# EAGLE schematic PCB (EAGLE 9.5.2)
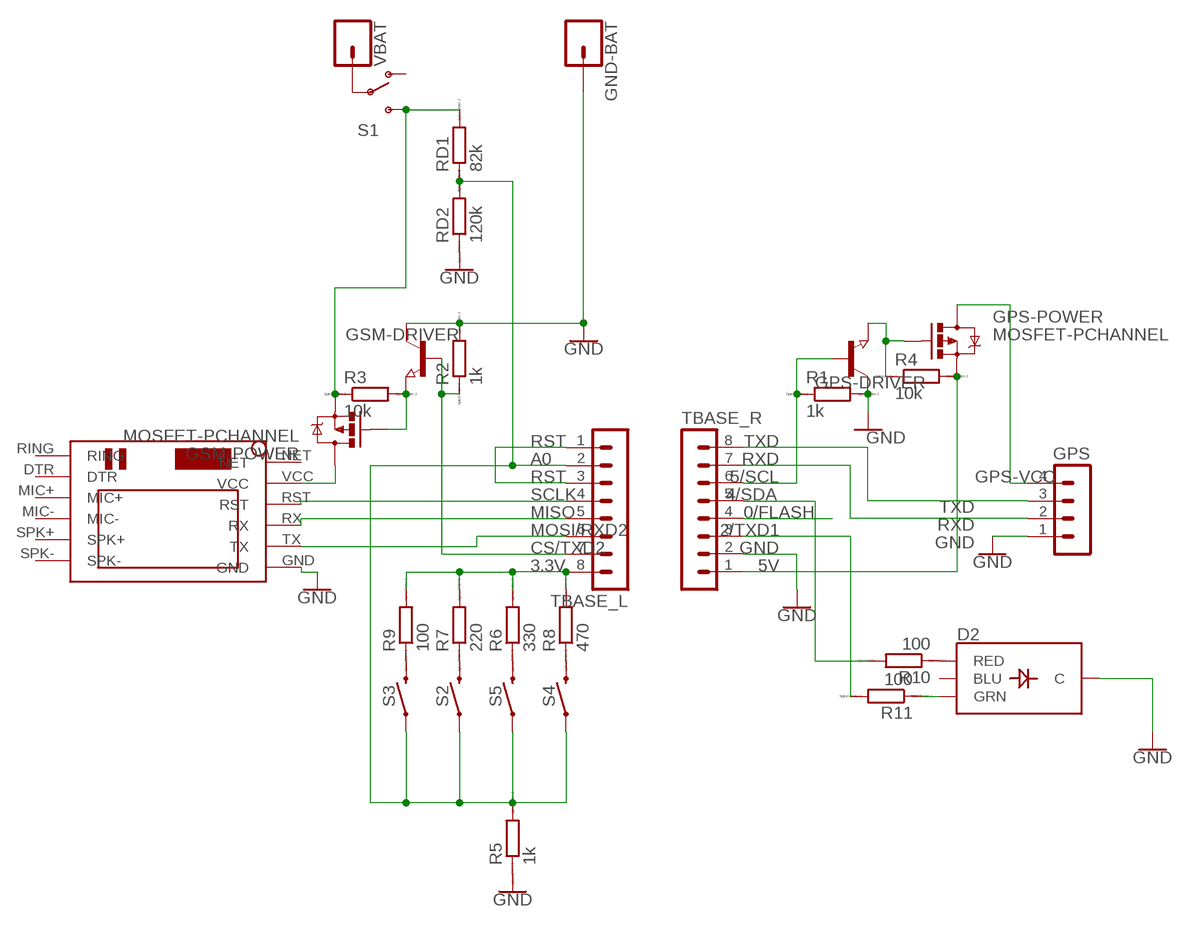
[diagram p0: schematic, sheet 1]

## Parts
D2  LED-RGB-CCPIRANHA  [LED_PIRANHA_5MM]
GND-BAT  CONN_01OFFSET  [1X01_OFFSET]
GPS  MA04-1  [MA04-1]
GPS-DRIVER  NPN-TRANSISTOR_SOT23  [SOT23]
GPS-POWER  MOSFET-PCHANNEL  [SOT23-3]
GSM-DRIVER  NPN-TRANSISTOR_SOT23  [SOT23]
GSM-POWER  MOSFET-PCHANNEL  [SOT23-3]
R1  1k  RR0402  [R0402]
R2  1k  RR0402  [R0402]
R3  10k  RR0603  [R0603]
R4  10k  RR0603  [R0603]
R5  1k  RR0603  [R0603]
R6  330  RR0603  [R0603]
R7  220  RR0603  [R0603]
R8  470  RR0603  [R0603]
R9  100  RR0603  [R0603]
R10  100  RR0603  [R0603]
R11  100  RR0603  [R0603]
RD1  82k  RR0402  [R0402]
RD2  120k  RR0402  [R0402]
S1  SWITCH-SPDTSMD  [SWITCH_SPDT_SMD]
S2  MOMENTARY-SWITCH-SPST-SMD-6.0X3.5MM  [TACTILE_SWITCH_SMD_6.0X3.5MM]
S3  MOMENTARY-SWITCH-SPST-SMD-6.0X3.5MM  [TACTILE_SWITCH_SMD_6.0X3.5MM]
S4  MOMENTARY-SWITCH-SPST-SMD-6.0X3.5MM  [TACTILE_SWITCH_SMD_6.0X3.5MM]
S5  MOMENTARY-SWITCH-SPST-SMD-6.0X3.5MM  [TACTILE_SWITCH_SMD_6.0X3.5MM]
TBASE_L  MA08-1  [MA08-1]
TBASE_R  MA08-1  [MA08-1]
U$1  SIM800LMODULE  [SIM800LMODULE]
VBAT  CONN_01OFFSET  [1X01_OFFSET]

## Nets
0/FLASH: TBASE_R.4
2/TXD1: R11.2 TBASE_R.3
3.3V: R6.2 R7.2 R8.2 R9.2 TBASE_L.8
4/SDA: R10.2 TBASE_R.5
5/SCL: GPS-DRIVER.1(B) R1.1 TBASE_R.6
5V: GPS-POWER.2(S) R4.2 TBASE_R.1
A0: R5.2 RD1.1 RD2.2 S2.1 S3.1 S4.1 S5.1 TBASE_L.2
CS/TXD2: GSM-DRIVER.1(B) R2.1 TBASE_L.7
GND: D2.-(C) GND-BAT.1 GPS-DRIVER.3(C) GPS.1 GSM-DRIVER.3(C) R1.2 R2.2 R5.1 RD2.1 TBASE_R.2 U$1.GND
GPS-VCC: GPS-POWER.3(D) GPS.4
MISO: TBASE_L.5 U$1.RX
MOSI/RXD2: TBASE_L.6 U$1.TX
N$1: S1.2(P) VBAT.1
N$2: GPS-DRIVER.2(E) GPS-POWER.1(G) R4.1
N$3: GSM-POWER.2(S) R3.1 RD1.2 S1.3(S)
N$4: GSM-POWER.3(D) U$1.VCC
N$5: GSM-DRIVER.2(E) GSM-POWER.1(G) R3.2
N$6: R8.1 S4.2
N$7: R6.1 S5.2
N$8: R7.1 S2.2
N$9: R9.1 S3.2
N$10: D2.R(RED) R10.1
N$11: D2.G(GRN) R11.1
RST: TBASE_L.1 TBASE_L.3
RXD: GPS.2 TBASE_R.7
SCLK: TBASE_L.4 U$1.RST
TXD: GPS.3 TBASE_R.8
Unconnected: D2.B(BLU) S1.1(O) U$1.DTR U$1.MIC+ U$1.MIC- U$1.NET U$1.RING U$1.SPK+ U$1.SPK-

## Library data of the parts
D2 = SparkFun-LED:LED-RGB-CC: LED-RGB Common Cathode Packages: LED RGB-THRU LED_PIRANHA_5MM SparkFun Products: RGB Diffused Common Cathode- Diffuse <[https://www.sparkfun.com/products/9264]> RGB Diffused Common Cathode - Clear <[https://www.sparkfun.com/products/105]> LED-RGB 5mm Square (Piranha) <[https://www.sparkfun.com/products/11679]>; SF_ID: COM-11679
GND-BAT VBAT = SparkFun-Connectors:CONN_01: Single connection point. Often used as Generic Header-pin footprint for 0.1 inch spaced/style header connections On any of the 0.1 inch spaced packages, you can populate with these: Break Away Headers - Straight <https://www.sparkfun.com/products/116> (PRT-00116) Break Away Male Headers - Right Angle <https://www.sparkfun.com/products/553> (PRT-00553) Female Headers <https://www.sparkfun.com/products/115> (PRT-00115) Break Away Headers - Machine Pin <https://www.sparkfun.com/products/117> (PRT-00117) Break Away Female Headers - Swiss Machine Pin <https://www.sparkfun.com/products/743> (PRT-00743) This device is also useful as a general connection point to wire up your design to another part of your project. Our various solder wires solder well into these plated through hole pads. Hook-Up Wire - Assortment (Stranded, 22 AWG) <https://www.sparkfun.com/products/11375> (PRT-11375) Hook-Up Wire - Assortment (Solid Core, 22 AWG) <https://www.sparkfun.com/products/11367> (PRT-11367) View the entire wire category on our website here <https://www.sparkfun.com/categories/141> Special notes: SMTSO-256-ET is a "flush mount" nut for a 4-40 screw. We mostly use this on specialty testbeds; it is a nice way to connect hardware to your PCB at an adjustable hieght. Also note, the SNAP packages are for using a snappable style connector. We sell a baggie of snaps and they are also used on two LilyPad designs: Snap Assortment - 30 pack (male and female) <https://www.sparkfun.com/products/11347> (DEV-11347) LilyPad Arduino SimpleSnap <https://www.sparkfun.com/products/10941> (DEV-10941) LilyPad SimpleSnap Protoboard <https://www.sparkfun.com/products/10940> (DEV-10940)
GPS = con-lstb:MA04-1: PIN HEADER; OC_FARNELL: unknown; OC_NEWARK: unknown
GPS-DRIVER GSM-DRIVER = semicon-smd-ipc:NPN-TRANSISTOR_: NPN TRANSISTOR
GPS-POWER GSM-POWER = User-Submitted:MOSFET-PCHANNEL: Generic PMOSFET IRLML2244 - TRANS-11153 (SOT-23 -20V -4.3A) (1.Gate 2.Source 3.Drain) FQP27P06 - COM-10349 <http://www.sparkfun.com/products/10349> (TO-220 -60V -27A) (1.Gate 2.Source 3.Drain); PROD_ID: TRANS-08285
R1-R11 RD1 RD2 = eagle-ltspice:R: RESISTOR, European symbol; SPICEMODEL: NONE; SPICEPREFIX: R
S1 = SparkFun-Retired:SWITCH-SPDT: SPDT Switch Simple slide switch, Spark Fun Electronics SKU : COM-00102 DPDT SMT slide switch, AYZ0202, SWCH-08179
S2-S5 = SparkFun-Switches:MOMENTARY-SWITCH-SPST: Momentary Switch (Pushbutton) - SPST Normally-open (NO) SPST momentary switches (buttons, pushbuttons). Variants PTH-12MM - 12mm square, through-hole Momentary Pushbutton Switch - 12mm Square <https://www.sparkfun.com/products/9190> (COM-09190) PTH-6.0MM, PTH-6.0MM-KIT - 6.0mm square, through-hole Mini Pushbutton Switch <https://www.sparkfun.com/products/97> (COM-00097) KIT package intended for soldering kit's - only one side of pads' copper is exposed. PTH-RIGHT-ANGLE-KIT - Right-angle, through-hole Right Angle Tactile Button <https://www.sparkfun.com/products/10791> - Used on SparkFun BigTime Watch Kit <https://www.sparkfun.com/products/11734> SMD-12MM - 12mm square, surface-mount Tactile Button - SMD (12mm) <https://www.sparkfun.com/products/12993> (COM-12993) Used on SparkFun PicoBoard <https://www.sparkfun.com/products/11888> SMD-4.5MM - 4.5mm Square Trackball Switch Used on SparkFun Blackberry Trackballer Breakout <https://www.sparkfun.com/products/13169> SMD-4.6MMX2.8MM - 4.60mm x 2.80mm, surface mount Used on SparkFun SAMD21 Mini Breakout <https://www.sparkfun.com/products/13664> SMD-5.2MM, SMD-5.2-REDUNDANT - 5.2mm square, surface-mount Mini Pushbutton Switch - SMD <https://www.sparkfun.com/products/8720> (COM-08720) Used on Arduino Pro Mini <https://www.sparkfun.com/products/11114> REDUNDANT package connects both switch circuits together SMD-6.0X3.5MM - 6.0 x 3.5mm, surface mount Momentary Reset Switch SMD <https://www.sparkfun.com/products/8229> (COM-08229) SMD-6.2MM-TALL - 6.2mm square, surface mount Tactile Button - SMD (6mm) <https://www.sparkfun.com/products/12992> Used on SparkFun Digital Sandbox <https://www.sparkfun.com/products/12651> SMD-RIGHT-ANGLE - Right-angle, surface mount Used on SparkFun Block for Intel® Edison - Arduino <https://www.sparkfun.com/products/13036>; PROD_ID: SWCH-14278; SF_SKU: COM-08229
TBASE_L TBASE_R = con-lstb:MA08-1: PIN HEADER; OC_FARNELL: unknown; OC_NEWARK: unknown
U$1 = SIM800LMODULE:SIM800LMODULE: SIM800L Module

## Module TTGOTBASE
Ports: 

### Library data of the parts